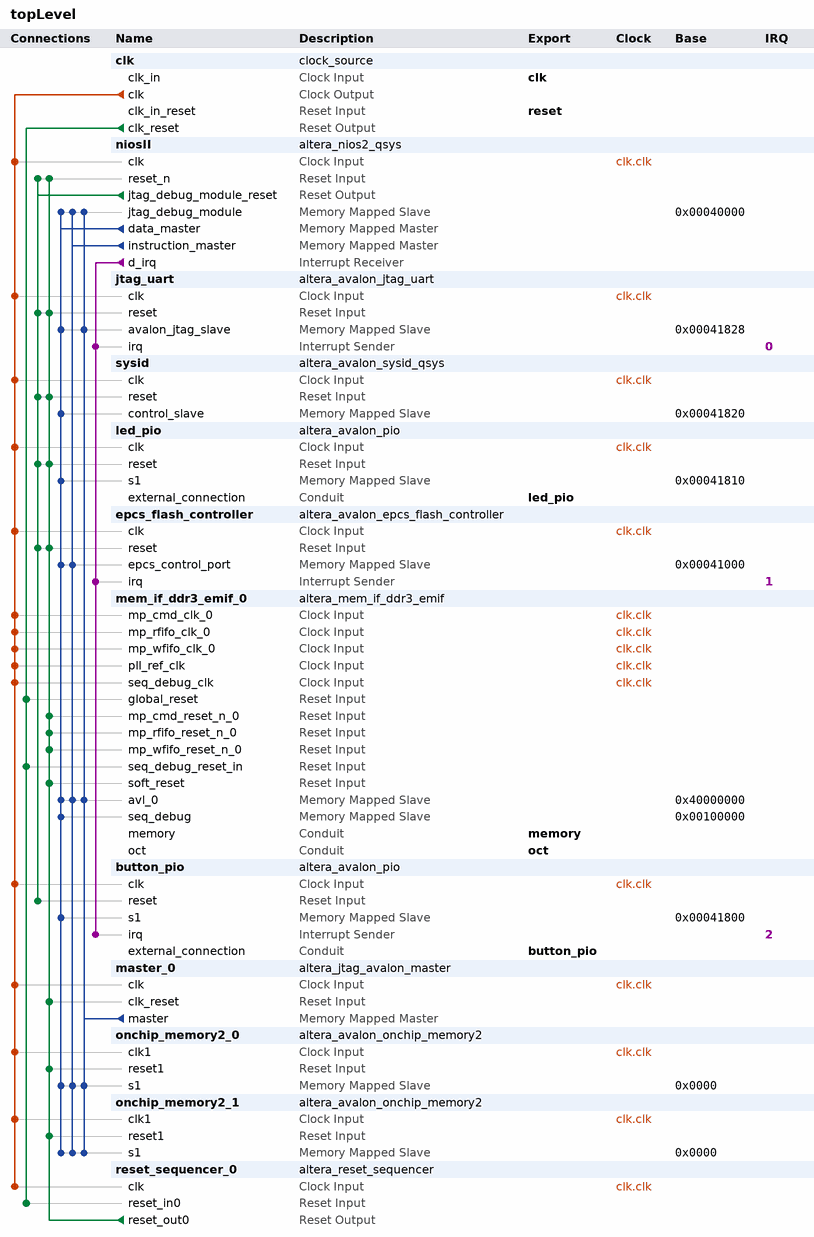
[diagram p0: system contents]
# Platform Designer (Qsys) system topLevel, Cyclone V 5CSXFC6D6F31C8ES
# Parameters at their usual value, and those the tool derives, are not listed.
package require -exact qsys 14.0
create_system topLevel
set_project_property DEVICE_FAMILY {Cyclone V}
set_project_property DEVICE 5CSXFC6D6F31C8ES

add_instance clk clock_source 14.0
set_instance_parameter_value clk clockFrequency 50000000

add_instance niosII altera_nios2_qsys 14.0
set_instance_parameter_value niosII debug_embeddedPLL false
set_instance_parameter_value niosII resetrequest_enabled true
set_instance_parameter_value niosII resetSlave epcs_flash_controller.epcs_control_port
set_instance_parameter_value niosII mmu_TLBMissExcSlave None
set_instance_parameter_value niosII exceptionSlave mem_if_ddr3_emif_0.avl_0
set_instance_parameter_value niosII breakSlave niosII.jtag_debug_module
set_instance_parameter_value niosII impl Fast
set_instance_parameter_value niosII icache_size 4096
set_instance_parameter_value niosII debug_level Level2

add_instance jtag_uart altera_avalon_jtag_uart 14.0
set_instance_parameter_value jtag_uart simInteractiveOptions NO_INTERACTIVE_WINDOWS

add_instance sysid altera_avalon_sysid_qsys 14.0
set_instance_parameter_value sysid id 195948557

add_instance led_pio altera_avalon_pio 14.0
set_instance_parameter_value led_pio direction Output
set_instance_parameter_value led_pio width 4

add_instance epcs_flash_controller altera_avalon_epcs_flash_controller 14.0
set_instance_parameter_value epcs_flash_controller useASMIAtom true
set_instance_parameter_value epcs_flash_controller resetrequest_enabled true

add_instance mem_if_ddr3_emif_0 altera_mem_if_ddr3_emif 14.0
set_instance_parameter_value mem_if_ddr3_emif_0 MEM_VENDOR JEDEC
set_instance_parameter_value mem_if_ddr3_emif_0 MEM_FORMAT DISCRETE
set_instance_parameter_value mem_if_ddr3_emif_0 MEM_CLK_FREQ_MAX 800.0
set_instance_parameter_value mem_if_ddr3_emif_0 MEM_ROW_ADDR_WIDTH 15
set_instance_parameter_value mem_if_ddr3_emif_0 MEM_COL_ADDR_WIDTH 10
set_instance_parameter_value mem_if_ddr3_emif_0 MEM_DQ_WIDTH 32
set_instance_parameter_value mem_if_ddr3_emif_0 MEM_BANKADDR_WIDTH 3
set_instance_parameter_value mem_if_ddr3_emif_0 MEM_DRV_STR RZQ/6
set_instance_parameter_value mem_if_ddr3_emif_0 MEM_RTT_WR {Dynamic ODT off}
set_instance_parameter_value mem_if_ddr3_emif_0 MEM_WTCL 6
set_instance_parameter_value mem_if_ddr3_emif_0 MEM_TCL 7
set_instance_parameter_value mem_if_ddr3_emif_0 TIMING_TIS 170
set_instance_parameter_value mem_if_ddr3_emif_0 TIMING_TIH 120
set_instance_parameter_value mem_if_ddr3_emif_0 TIMING_TDS 10
set_instance_parameter_value mem_if_ddr3_emif_0 TIMING_TDH 45
set_instance_parameter_value mem_if_ddr3_emif_0 TIMING_TDQSQ 100
set_instance_parameter_value mem_if_ddr3_emif_0 TIMING_TDQSCK 255
set_instance_parameter_value mem_if_ddr3_emif_0 TIMING_TDQSS 0.27
set_instance_parameter_value mem_if_ddr3_emif_0 TIMING_TQSH 0.4
set_instance_parameter_value mem_if_ddr3_emif_0 TIMING_TDSH 0.18
set_instance_parameter_value mem_if_ddr3_emif_0 TIMING_TDSS 0.18
set_instance_parameter_value mem_if_ddr3_emif_0 MEM_TRAS_NS 35.0
set_instance_parameter_value mem_if_ddr3_emif_0 MEM_TRCD_NS 13.75
set_instance_parameter_value mem_if_ddr3_emif_0 MEM_TRP_NS 13.75
set_instance_parameter_value mem_if_ddr3_emif_0 MEM_TRFC_NS 260.0
set_instance_parameter_value mem_if_ddr3_emif_0 MEM_TWTR 4
set_instance_parameter_value mem_if_ddr3_emif_0 MEM_TFAW_NS 30.0
set_instance_parameter_value mem_if_ddr3_emif_0 MEM_TRRD_NS 10.0
set_instance_parameter_value mem_if_ddr3_emif_0 MEM_TRTP_NS 10.0
set_instance_parameter_value mem_if_ddr3_emif_0 RATE Full
set_instance_parameter_value mem_if_ddr3_emif_0 MEM_CLK_FREQ 400.0
set_instance_parameter_value mem_if_ddr3_emif_0 SPEED_GRADE 8
set_instance_parameter_value mem_if_ddr3_emif_0 HARD_EMIF true
set_instance_parameter_value mem_if_ddr3_emif_0 POWER_OF_TWO_BUS false
set_instance_parameter_value mem_if_ddr3_emif_0 AVL_MAX_SIZE 1
set_instance_parameter_value mem_if_ddr3_emif_0 PRIORITY_PORT 1,1,1,1,1,1
set_instance_parameter_value mem_if_ddr3_emif_0 CPORT_TYPE_PORT Bidirectional,Bidirectional,Bidirectional,Bidirectional,Bidirectional,Bidirectional
set_instance_parameter_value mem_if_ddr3_emif_0 REF_CLK_FREQ 50.0
set_instance_parameter_value mem_if_ddr3_emif_0 EXPORT_AFI_HALF_CLK false
set_instance_parameter_value mem_if_ddr3_emif_0 PLL_LOCATION Top_Bottom
set_instance_parameter_value mem_if_ddr3_emif_0 CALIBRATION_MODE Skip
set_instance_parameter_value mem_if_ddr3_emif_0 USER_DEBUG_LEVEL 1
set_instance_parameter_value mem_if_ddr3_emif_0 TIMING_BOARD_MAX_CK_DELAY 0.6
set_instance_parameter_value mem_if_ddr3_emif_0 TIMING_BOARD_MAX_DQS_DELAY 0.6
set_instance_parameter_value mem_if_ddr3_emif_0 TIMING_BOARD_SKEW_CKDQS_DIMM_MIN -0.01
set_instance_parameter_value mem_if_ddr3_emif_0 TIMING_BOARD_SKEW_CKDQS_DIMM_MAX 0.01
set_instance_parameter_value mem_if_ddr3_emif_0 TIMING_BOARD_SKEW_WITHIN_DQS 0.02
set_instance_parameter_value mem_if_ddr3_emif_0 TIMING_BOARD_SKEW_BETWEEN_DQS 0.02
set_instance_parameter_value mem_if_ddr3_emif_0 TIMING_BOARD_DQ_TO_DQS_SKEW 0.0
set_instance_parameter_value mem_if_ddr3_emif_0 TIMING_BOARD_AC_SKEW 0.02
set_instance_parameter_value mem_if_ddr3_emif_0 TIMING_BOARD_AC_TO_CK_SKEW 0.0
set_instance_parameter_value mem_if_ddr3_emif_0 ENABLE_EXPORT_SEQ_DEBUG_BRIDGE true

add_instance button_pio altera_avalon_pio 14.0
set_instance_parameter_value button_pio bitClearingEdgeCapReg true
set_instance_parameter_value button_pio captureEdge true
set_instance_parameter_value button_pio direction Input
set_instance_parameter_value button_pio edgeType FALLING
set_instance_parameter_value button_pio generateIRQ true
set_instance_parameter_value button_pio irqType EDGE
set_instance_parameter_value button_pio width 2

add_instance master_0 altera_jtag_avalon_master 14.0

add_instance onchip_memory2_0 altera_avalon_onchip_memory2 14.0
set_instance_parameter_value onchip_memory2_0 dataWidth 32
set_instance_parameter_value onchip_memory2_0 dualPort false
set_instance_parameter_value onchip_memory2_0 initMemContent true
set_instance_parameter_value onchip_memory2_0 initializationFileName onchip_mem.hex
set_instance_parameter_value onchip_memory2_0 memorySize 262144

add_instance onchip_memory2_1 altera_avalon_onchip_memory2 14.0
set_instance_parameter_value onchip_memory2_1 dataWidth 32
set_instance_parameter_value onchip_memory2_1 dualPort false
set_instance_parameter_value onchip_memory2_1 initMemContent true
set_instance_parameter_value onchip_memory2_1 initializationFileName onchip_mem.hex
set_instance_parameter_value onchip_memory2_1 memorySize 4096

add_instance reset_sequencer_0 altera_reset_sequencer 14.0
set_instance_parameter_value reset_sequencer_0 NUM_OUTPUTS 2
set_instance_parameter_value reset_sequencer_0 NUM_INPUTS 1
set_instance_parameter_value reset_sequencer_0 ENABLE_RESET_REQUEST_INPUT 0
set_instance_parameter_value reset_sequencer_0 MIN_ASRT_TIME 1
set_instance_parameter_value reset_sequencer_0 ENABLE_CSR 0
set_instance_parameter_value reset_sequencer_0 LIST_ASRT_SEQ 0,1,2,3,4,5,6,7,8,9
set_instance_parameter_value reset_sequencer_0 LIST_DSRT_SEQ 0,1,2,3,4,5,6,7,8,9
set_instance_parameter_value reset_sequencer_0 LIST_ASRT_DELAY 0,0,0,0,0,0,0,0,0,0
set_instance_parameter_value reset_sequencer_0 LIST_DSRT_DELAY 8,8,0,0,0,0,0,0,0,0
set_instance_parameter_value reset_sequencer_0 USE_DSRT_QUAL 0,0,0,0,0,0,0,0,0,0

# connections
add_connection clk.clk button_pio.clk clock
add_connection clk.clk epcs_flash_controller.clk clock
add_connection clk.clk jtag_uart.clk clock
add_connection clk.clk led_pio.clk clock
add_connection clk.clk master_0.clk clock
add_connection clk.clk mem_if_ddr3_emif_0.mp_cmd_clk_0 clock
add_connection clk.clk mem_if_ddr3_emif_0.mp_rfifo_clk_0 clock
add_connection clk.clk mem_if_ddr3_emif_0.mp_wfifo_clk_0 clock
add_connection clk.clk mem_if_ddr3_emif_0.pll_ref_clk clock
add_connection clk.clk mem_if_ddr3_emif_0.seq_debug_clk clock
add_connection clk.clk niosII.clk clock
add_connection clk.clk onchip_memory2_0.clk1 clock
add_connection clk.clk onchip_memory2_1.clk1 clock
add_connection clk.clk reset_sequencer_0.clk clock
add_connection clk.clk sysid.clk clock
add_connection clk.clk_reset mem_if_ddr3_emif_0.global_reset reset
add_connection clk.clk_reset mem_if_ddr3_emif_0.seq_debug_reset_in reset
add_connection clk.clk_reset reset_sequencer_0.reset_in0 reset
add_connection niosII.jtag_debug_module_reset button_pio.reset reset
add_connection niosII.jtag_debug_module_reset epcs_flash_controller.reset reset
add_connection niosII.jtag_debug_module_reset jtag_uart.reset reset
add_connection niosII.jtag_debug_module_reset led_pio.reset reset
add_connection niosII.jtag_debug_module_reset niosII.reset_n reset
add_connection niosII.jtag_debug_module_reset sysid.reset reset
add_connection reset_sequencer_0.reset_out0 epcs_flash_controller.reset reset
add_connection reset_sequencer_0.reset_out0 jtag_uart.reset reset
add_connection reset_sequencer_0.reset_out0 led_pio.reset reset
add_connection reset_sequencer_0.reset_out0 master_0.clk_reset reset
add_connection reset_sequencer_0.reset_out0 mem_if_ddr3_emif_0.mp_cmd_reset_n_0 reset
add_connection reset_sequencer_0.reset_out0 mem_if_ddr3_emif_0.mp_rfifo_reset_n_0 reset
add_connection reset_sequencer_0.reset_out0 mem_if_ddr3_emif_0.mp_wfifo_reset_n_0 reset
add_connection reset_sequencer_0.reset_out0 mem_if_ddr3_emif_0.soft_reset reset
add_connection reset_sequencer_0.reset_out0 niosII.reset_n reset
add_connection reset_sequencer_0.reset_out0 onchip_memory2_0.reset1 reset
add_connection reset_sequencer_0.reset_out0 onchip_memory2_1.reset1 reset
add_connection reset_sequencer_0.reset_out0 sysid.reset reset
add_connection master_0.master jtag_uart.avalon_jtag_slave avalon
set_connection_parameter_value master_0.master/jtag_uart.avalon_jtag_slave baseAddress 0x00041828
add_connection master_0.master mem_if_ddr3_emif_0.avl_0 avalon
set_connection_parameter_value master_0.master/mem_if_ddr3_emif_0.avl_0 baseAddress 0x40000000
add_connection master_0.master niosII.jtag_debug_module avalon
set_connection_parameter_value master_0.master/niosII.jtag_debug_module baseAddress 0x00040000
add_connection master_0.master onchip_memory2_0.s1 avalon
set_connection_parameter_value master_0.master/onchip_memory2_0.s1 baseAddress 0x0000
add_connection master_0.master onchip_memory2_1.s1 avalon
set_connection_parameter_value master_0.master/onchip_memory2_1.s1 baseAddress 0x0000
set_connection_parameter_value master_0.master/onchip_memory2_1.s1 defaultConnection true
add_connection niosII.data_master button_pio.s1 avalon
set_connection_parameter_value niosII.data_master/button_pio.s1 baseAddress 0x00041800
add_connection niosII.data_master epcs_flash_controller.epcs_control_port avalon
set_connection_parameter_value niosII.data_master/epcs_flash_controller.epcs_control_port baseAddress 0x00041000
add_connection niosII.data_master jtag_uart.avalon_jtag_slave avalon
set_connection_parameter_value niosII.data_master/jtag_uart.avalon_jtag_slave baseAddress 0x00041828
add_connection niosII.data_master led_pio.s1 avalon
set_connection_parameter_value niosII.data_master/led_pio.s1 baseAddress 0x00041810
add_connection niosII.data_master mem_if_ddr3_emif_0.avl_0 avalon
set_connection_parameter_value niosII.data_master/mem_if_ddr3_emif_0.avl_0 baseAddress 0x40000000
add_connection niosII.data_master mem_if_ddr3_emif_0.seq_debug avalon
set_connection_parameter_value niosII.data_master/mem_if_ddr3_emif_0.seq_debug baseAddress 0x00100000
add_connection niosII.data_master niosII.jtag_debug_module avalon
set_connection_parameter_value niosII.data_master/niosII.jtag_debug_module baseAddress 0x00040000
add_connection niosII.data_master onchip_memory2_0.s1 avalon
set_connection_parameter_value niosII.data_master/onchip_memory2_0.s1 baseAddress 0x0000
add_connection niosII.data_master onchip_memory2_1.s1 avalon
set_connection_parameter_value niosII.data_master/onchip_memory2_1.s1 baseAddress 0x0000
set_connection_parameter_value niosII.data_master/onchip_memory2_1.s1 defaultConnection true
add_connection niosII.data_master sysid.control_slave avalon
set_connection_parameter_value niosII.data_master/sysid.control_slave baseAddress 0x00041820
add_connection niosII.instruction_master epcs_flash_controller.epcs_control_port avalon
set_connection_parameter_value niosII.instruction_master/epcs_flash_controller.epcs_control_port baseAddress 0x00041000
add_connection niosII.instruction_master mem_if_ddr3_emif_0.avl_0 avalon
set_connection_parameter_value niosII.instruction_master/mem_if_ddr3_emif_0.avl_0 baseAddress 0x40000000
add_connection niosII.instruction_master niosII.jtag_debug_module avalon
set_connection_parameter_value niosII.instruction_master/niosII.jtag_debug_module baseAddress 0x00040000
add_connection niosII.instruction_master onchip_memory2_0.s1 avalon
set_connection_parameter_value niosII.instruction_master/onchip_memory2_0.s1 baseAddress 0x0000
add_connection niosII.instruction_master onchip_memory2_1.s1 avalon
set_connection_parameter_value niosII.instruction_master/onchip_memory2_1.s1 baseAddress 0x0000
set_connection_parameter_value niosII.instruction_master/onchip_memory2_1.s1 defaultConnection true
add_connection niosII.d_irq button_pio.irq interrupt
set_connection_parameter_value niosII.d_irq/button_pio.irq irqNumber 2
add_connection niosII.d_irq epcs_flash_controller.irq interrupt
set_connection_parameter_value niosII.d_irq/epcs_flash_controller.irq irqNumber 1
add_connection niosII.d_irq jtag_uart.irq interrupt
set_connection_parameter_value niosII.d_irq/jtag_uart.irq irqNumber 0

# exported interfaces
add_interface clk clock sink
set_interface_property clk EXPORT_OF clk.clk_in
add_interface reset reset sink
set_interface_property reset EXPORT_OF clk.clk_in_reset
add_interface memory conduit end
set_interface_property memory EXPORT_OF mem_if_ddr3_emif_0.memory
add_interface oct conduit end
set_interface_property oct EXPORT_OF mem_if_ddr3_emif_0.oct
add_interface led_pio conduit end
set_interface_property led_pio EXPORT_OF led_pio.external_connection
add_interface button_pio conduit end
set_interface_property button_pio EXPORT_OF button_pio.external_connection

set_interconnect_requirement {$system} qsys_mm.clockCrossingAdapter HANDSHAKE
set_interconnect_requirement {$system} qsys_mm.maxAdditionalLatency 1

save_system topLevel.qsys
